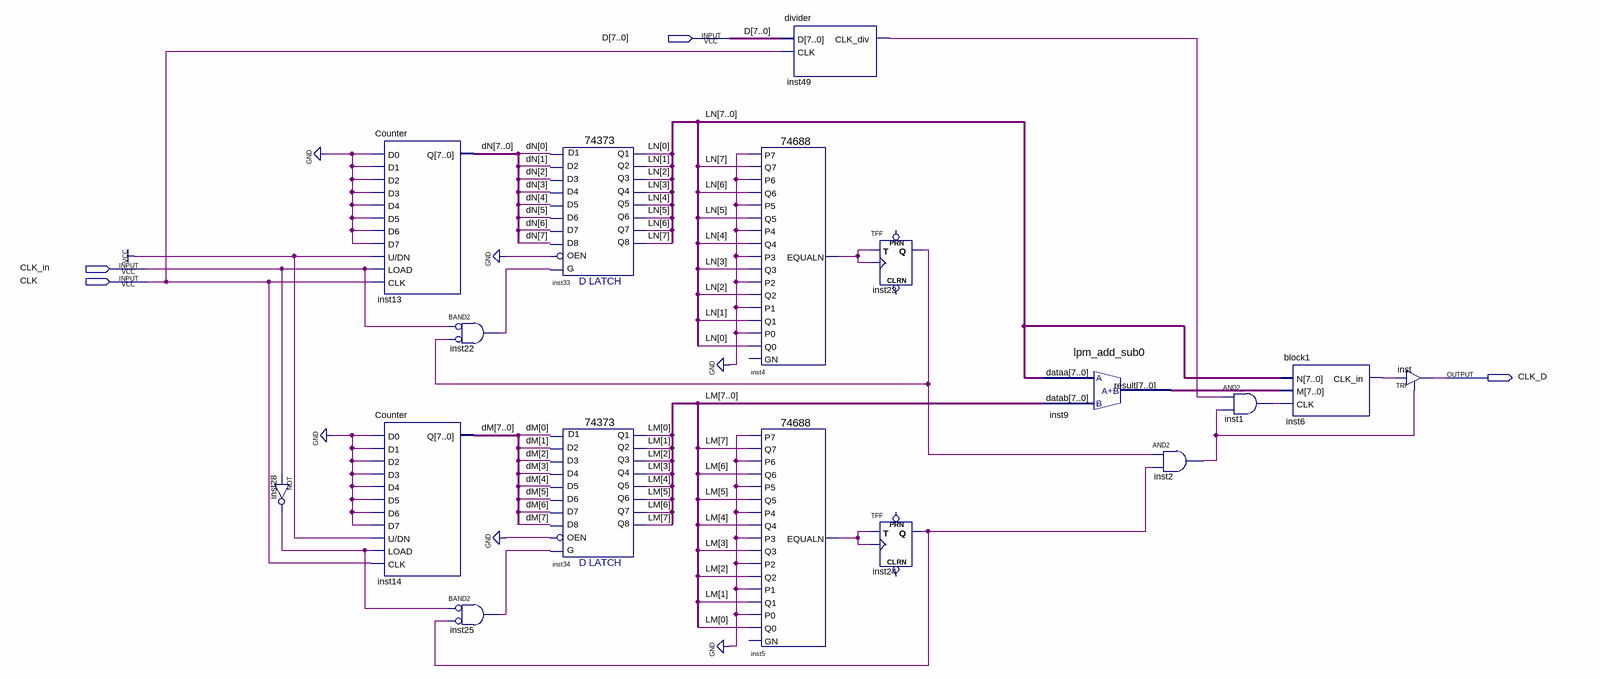
[diagram p0: schematic sheet]
// Quartus schematic block2.bdf as structural Verilog: 17 symbols, 4 pins
module block2 (
  input  [7:0] D,
  input  CLK_in,
  input  CLK,
  output CLK_D
);

  wire inst1_out, inst2_out, inst4_equaln, inst5_equaln, inst6_clk_in, inst22_out, inst23_q, inst24_q,
       inst25_out, inst28_out, inst49_clk_div;
  wire [7:0] dM, dN, inst9_result, LM, LN;

  not inst28 (inst28_out, CLK_in);
  Counter inst13 (
    .D0(1'b0), .D1(1'b0), .D2(1'b0), .D3(1'b0), .D4(1'b0), .D5(1'b0), .D6(1'b0), .D7(1'b0), .\U/DN (1'b1),
    .LOAD(CLK_in), .CLK(CLK), .Q(dN));
  Counter inst14 (
    .D0(1'b0), .D1(1'b0), .D2(1'b0), .D3(1'b0), .D4(1'b0), .D5(1'b0), .D6(1'b0), .D7(1'b0), .\U/DN (1'b1),
    .LOAD(inst28_out), .CLK(CLK), .Q(dM));
  and inst22 (inst22_out, ~CLK_in, ~inst23_q);  // BAND2
  and inst25 (inst25_out, ~inst28_out, ~inst24_q);  // BAND2
  \74373  inst33 (
    .D1(dN[0]), .D3(dN[2]), .D6(dN[5]), .D7(dN[6]), .D2(dN[1]), .G(inst22_out), .D4(dN[3]), .D5(dN[4]),
    .D8(dN[7]), .OEN(1'b0), .Q3(LN[2]), .Q6(LN[5]), .Q7(LN[6]), .Q2(LN[1]), .Q8(LN[7]), .Q4(LN[3]),
    .Q5(LN[4]), .Q1(LN[0]));
  \74373  inst34 (
    .D1(dM[0]), .D3(dM[2]), .D6(dM[5]), .D7(dM[6]), .D2(dM[1]), .G(inst25_out), .D4(dM[3]), .D5(dM[4]),
    .D8(dM[7]), .OEN(1'b0), .Q3(LM[2]), .Q6(LM[5]), .Q7(LM[6]), .Q2(LM[1]), .Q8(LM[7]), .Q4(LM[3]),
    .Q5(LM[4]), .Q1(LM[0]));
  \74688  inst4 (
    .P6(1'b0), .Q3(LN[3]), .P3(1'b0), .Q4(LN[4]), .P4(1'b0), .Q2(LN[2]), .P1(1'b0), .Q1(LN[1]), .P0(1'b0),
    .Q0(LN[0]), .P2(1'b0), .Q7(LN[7]), .Q5(LN[5]), .P5(1'b0), .Q6(LN[6]), .P7(1'b0), .EQUALN(inst4_equaln));  // open: GN
  \74688  inst5 (
    .P6(1'b0), .Q3(LM[3]), .P3(1'b0), .Q4(LM[4]), .P4(1'b0), .Q2(LM[2]), .P1(1'b0), .Q1(LM[1]), .P0(1'b0),
    .Q0(LM[0]), .P2(1'b0), .Q7(LM[7]), .Q5(LM[5]), .P5(1'b0), .Q6(LM[6]), .P7(1'b0), .EQUALN(inst5_equaln));  // open: GN
  divider inst49 (.D(D), .CLK(CLK), .CLK_div(inst49_clk_div));
  TFF inst23 (.T(inst4_equaln), .CLK(inst4_equaln), .Q(inst23_q));  // open: PRN, CLRN
  TFF inst24 (.T(inst5_equaln), .CLK(inst5_equaln), .Q(inst24_q));  // open: PRN, CLRN
  lpm_add_sub0 inst9 (.dataa(LN), .datab(LM), .result(inst9_result));
  and inst2 (inst2_out, inst23_q, inst24_q);
  and inst1 (inst1_out, inst49_clk_div, inst2_out);
  block1 inst6 (.N(LN), .M(inst9_result), .CLK(inst1_out), .CLK_in(inst6_clk_in));
  TRI inst (.IN(inst6_clk_in), .OE(inst2_out), .OUT(CLK_D));
endmodule
